# Altium project GroundStation.PrjPcb
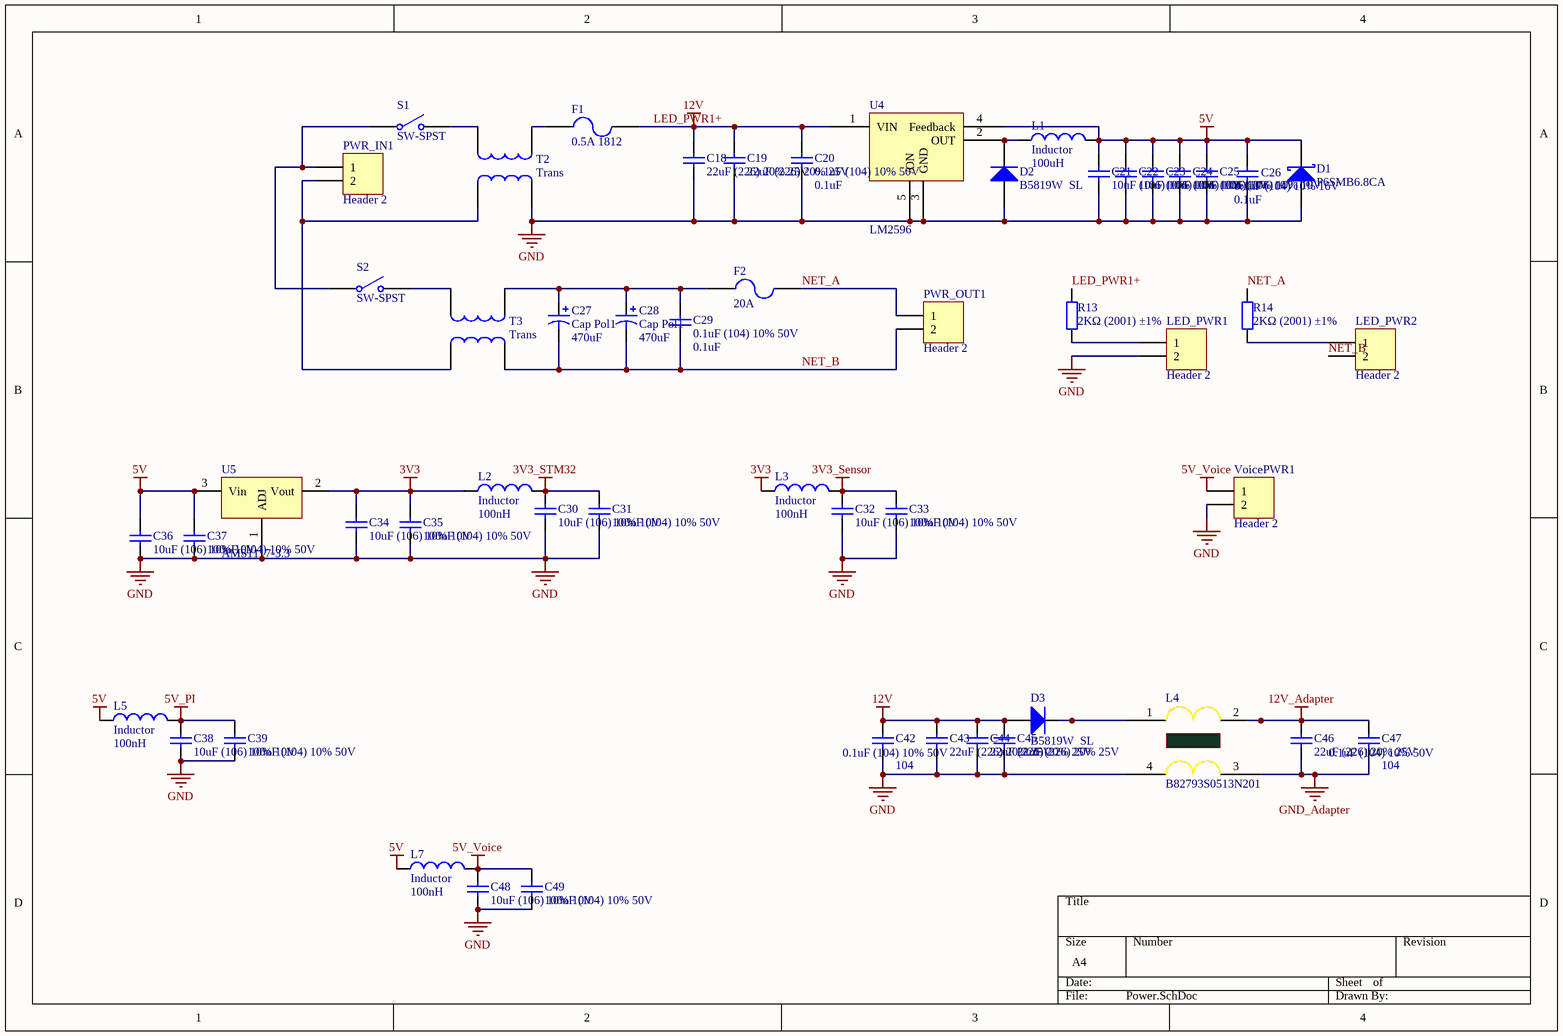
[diagram p0: Power.SchDoc]
4 sheets, 121 parts. Net scope: global (net labels, ports and power ports of the same name join across sheets).
Board file: GroundStation.PcbDoc
Sheets:
  Power.SchDoc
  State.SchDoc
  PLC_RaspberryPi.SchDoc
  MCU.SchDoc

## Sheet Power.SchDoc
size A4

### Parts
C18  22uF (226) 20% 25V  [0805_C]
C19  22uF (226) 20% 25V  [0805_C]
C20  0.1uF (104) 10% 50V  value 0.1uF  [0805_C]
C21  10uF (106) 10% 10V  [0603_C]
C22  10uF (106) 10% 10V  [0603_C]
C23  10uF (106) 10% 10V  [0603_C]
C24  10uF (106) 10% 10V  [0603_C]
C25  10uF (106) 10% 10V  [0603_C]
C26  0.1uF (104) 10% 16V  value 0.1uF  [0603_C]
C27  Cap Pol1  value 470uF  [RB5-10.5]
C28  Cap Pol1  value 470uF  [RB5-10.5]
C29  0.1uF (104) 10% 50V  value 0.1uF  [0805_C]
C30  10uF (106) 10% 10V  [0603_C]
C31  100nF (104) 10% 50V  [0603_C]
C32  10uF (106) 10% 10V  [0603_C]
C33  100nF (104) 10% 50V  [0603_C]
C34  10uF (106) 10% 10V  [0603_C]
C35  100nF (104) 10% 50V  [0603_C]
C36  10uF (106) 10% 10V  [0603_C]
C37  100nF (104) 10% 50V  [0603_C]
C38  10uF (106) 10% 10V  [0603_C]
C39  100nF (104) 10% 50V  [0603_C]
C42  0.1uF (104) 10% 50V  value 104  [0805_C]
C43  22uF (226) 20% 25V  [0805_C]
C44  22uF (226) 20% 25V  [0805_C]
C45  22uF (226) 20% 25V  [0805_C]
C46  22uF (226) 20% 25V  [0805_C]
C47  0.1uF (104) 10% 50V  value 104  [0805_C]
C48  10uF (106) 10% 10V  [0603_C]
C49  100nF (104) 10% 50V  [0603_C]
D1  P6SMB6.8CA  [SMB(DO-214AA)_S1]
D2  B5819W  SL  [SOD-123]
D3  B5819W  SL  [SOD-123]
F1  0.5A 1812  [1812]
F2  20A  [Fuse_Small]
L1  Inductor  value 100uH  [L1050(10x10x4)]
L2  Inductor  value 100nH  [0603_L]
L3  Inductor  value 100nH  [0603_L]
L4  B82793S0513N201  [B82793S0513N201_Yes]
L5  Inductor  value 100nH  [0603_L]
L7  Inductor  value 100nH  [0603_L]
LED_PWR1  Header 2  [XH2.54_2P]
LED_PWR2  Header 2  [XH2.54_2P]
PWR_IN1  Header 2  [T型口]
PWR_OUT1  Header 2  [T型口]
R13  2KΩ (2001) ±1%  [LC-0603_R]
R14  2KΩ (2001) ±1%  [LC-0603_R]
S1  SW-SPST  [XH2.54_2P]
S2  SW-SPST  [T型口]
T2  Trans  [UU9.8]
T3  Trans  [20A共模电感]
U4  LM2596  [TO-263-5]
U5  AMS1117-3.3  [SOT-223]
VoicePWR1  Header 2  [XH2.54_2P]

### Nets
3V3: C34.2 C35.2 L2.1 L3.1 U5.2(Vout)
3V3_Sensor: C32.2 C33.2 L3.2
3V3_STM32: C30.2 C31.2 L2.2
5V: C21.2 C22.2 C23.2 C24.2 C25.2 C26.2 C36.2 C37.2 D1.2(K) L1.2 L5.1 L7.1 U4.4(Feedback) U5.3(Vin)
5V_PI: C38.2 C39.2 L5.2
5V_Voice: C48.2 C49.2 L7.2 VoicePWR1.1
12V_Adapter: C46.2 C47.2 L4.2
GND: C18.1 C19.1 C20.1 C21.1 C22.1 C23.1 C24.1 C25.1 C26.1 C30.1 C31.1 C32.1 C33.1 C34.1 C35.1 C36.1 C37.1 C38.1 C39.1 C42.1 C43.1 C44.1 C45.1 C48.1 C49.1 D1.1(A) D2.1(A) L4.4 LED_PWR1.2 T2.2 U4.3(GND) U4.5(/ON) U5.1(ADJ) VoicePWR1.2
GND_Adapter: C46.1 C47.1 L4.3
LED_PWR1+: C18.2 C19.2 C20.2 C42.2 C43.2 C44.2 C45.2 D3.1(A) F1.2 R13.1 U4.1(VIN)  [also labelled 12V]
NET_A: F2.2 PWR_OUT1.1 R14.1
NET_B: C27.2 C28.2 C29.1 LED_PWR2.2 PWR_OUT1.2 T3.2
NetC27_1: C27.1 C28.1 C29.2 F2.1 T3.4
NetD2_2: D2.2(K) L1.1 U4.2(OUT)
NetD3_2: D3.2(K) L4.1
NetF1_1: F1.1 T2.4
NetLED_PWR1_1: LED_PWR1.1 R13.2
NetLED_PWR2_1: LED_PWR2.1 R14.2
NetPWR_IN1_1: PWR_IN1.1 S1.1(COMMON) S2.1(COMMON)
NetPWR_IN1_2: PWR_IN1.2 T2.1 T3.1
NetS1_2: S1.2(NO) T2.3
NetS2_2: S2.2(NO) T3.3

### Library data of the parts
C18 C19 C43-C46 = 0805 22uF (226) 20% 25V: 贴片电容; ComponentLink1Description: 供应商链接; ComponentLink1URL: http://www.szlcsc.com/product/details_46786.html; Package: 0805; Supplier: LC; SuppliersPartNumber: C45783
C20 C26 C29 C42 C47 = Cap: Capacitor; Published: 8-Jun-2000; LatestRevisionDate: 17-Jul-2002; LatestRevisionNote: Re-released for DXP Platform.; PackageReference: RAD-0.3; Publisher: Altium Limited; PackageDescription: Radial Cap, Thru-Hole; 2 Leads; 0.3 in Pin Spacing
C21-C25 C30 C32 C34 C36 C38 C48 = 0603 10uF (106) 10% 10V: 贴片电容; ComponentLink1Description: 供应商链接; ComponentLink1URL: http://www.szlcsc.com/product/details_20411.html; Package: 0603; Supplier: LC; SuppliersPartNumber: C19702
C27 C28 = Cap Pol1: Polarized Capacitor (Radial); Published: 8-Jun-2000; LatestRevisionDate: 17-Jul-2002; LatestRevisionNote: Re-released for DXP Platform.; PackageReference: RB7.6-15; Publisher: Altium Limited; PackageDescription: Polarized Capacitor (Radial); 2 Leads
C31 C33 C35 C37 C39 C49 = 0603 100nF (104) 10% 50V: 贴片电容; ComponentLink1Description: 供应商链接; ComponentLink1URL: http://www.szlcsc.com/product/details_15331.html; Package: 0603; Supplier: LC; SuppliersPartNumber: C14663
D1 = D Schottky: Schottky Diode; Published: 8-Jun-2000; LatestRevisionDate: 17-Jul-2002; LatestRevisionNote: Re-released for DXP Platform.; PackageReference: SMB; Publisher: Altium Limited; PackageDescription: DO-214-AA/SMB; 2 C-Bend Leads; Body 5.3 x 3.6 mm, inc. leads (LxW); Code_JEDEC: DO-214-AA
D2 D3 = SOD-123 B5819W  SL: 肖特基二极管; ComponentLink1Description: 供应商链接; ComponentLink1URL: http://www.szlcsc.com/product/details_9093.html; Package: SOD-123; Supplier: LC; SuppliersPartNumber: C8598
F1 F2 = Fuse 2: Fuse; Published: 8-Jun-2000; LatestRevisionDate: 17-Jul-2002; LatestRevisionNote: Re-released for DXP Platform.; PackageReference: PIN-W2/E2.8; Publisher: Altium Limited; PackageDescription: Thru-Hole; 2 Leads
L1-L3 L5 L7 = Inductor: Code_IEC: 1005; Published: 8-Jun-2000; LatestRevisionDate: 29-May-2009; LatestRevisionNote: IPC-7351 Footprint Added.; PackageReference: 0402-A; Publisher: Altium Limited; PackageDescription: Chip Inductor; Code_JEITA: 0402
LED_PWR1 LED_PWR2 PWR_IN1 PWR_OUT1 VoicePWR1 = Header 2: Header, 2-Pin; LatestRevisionDate: 17-Jul-2002; LatestRevisionNote: Re-released for DXP Platform.; Publisher: Altium Limited
R13 R14 = 0603 2KΩ (2001) 1%: 贴片电阻; ComponentLink1Description: 供应商链接; ComponentLink1URL: http://www.szlcsc.com/product/details_23702.html; Package: 0603; Supplier: LC; SuppliersPartNumber: C22975
S1 S2 = SW-SPST: Single-Pole, Single-Throw Switch; Published: 24-Mar-1999; LatestRevisionDate: 17-Jul-2002; LatestRevisionNote: Re-released for DXP Platform.; PackageReference: SPST-2; Publisher: Altium Limited; PackageDescription: Switch; 2 Leads
T2 T3 = Trans: Transformer; Published: 24-Mar-1999; LatestRevisionDate: 08-Jul-2005; LatestRevisionNote: Mech Layer 1 removed.; PackageReference: TRANS; Publisher: Altium Limited; PackageDescription: Transformer; 4 Leads
U4 = LM2576
U5 = LM317: 3-Terminal Adjustable Positive Voltage Regulator

## Sheet State.SchDoc
size A4
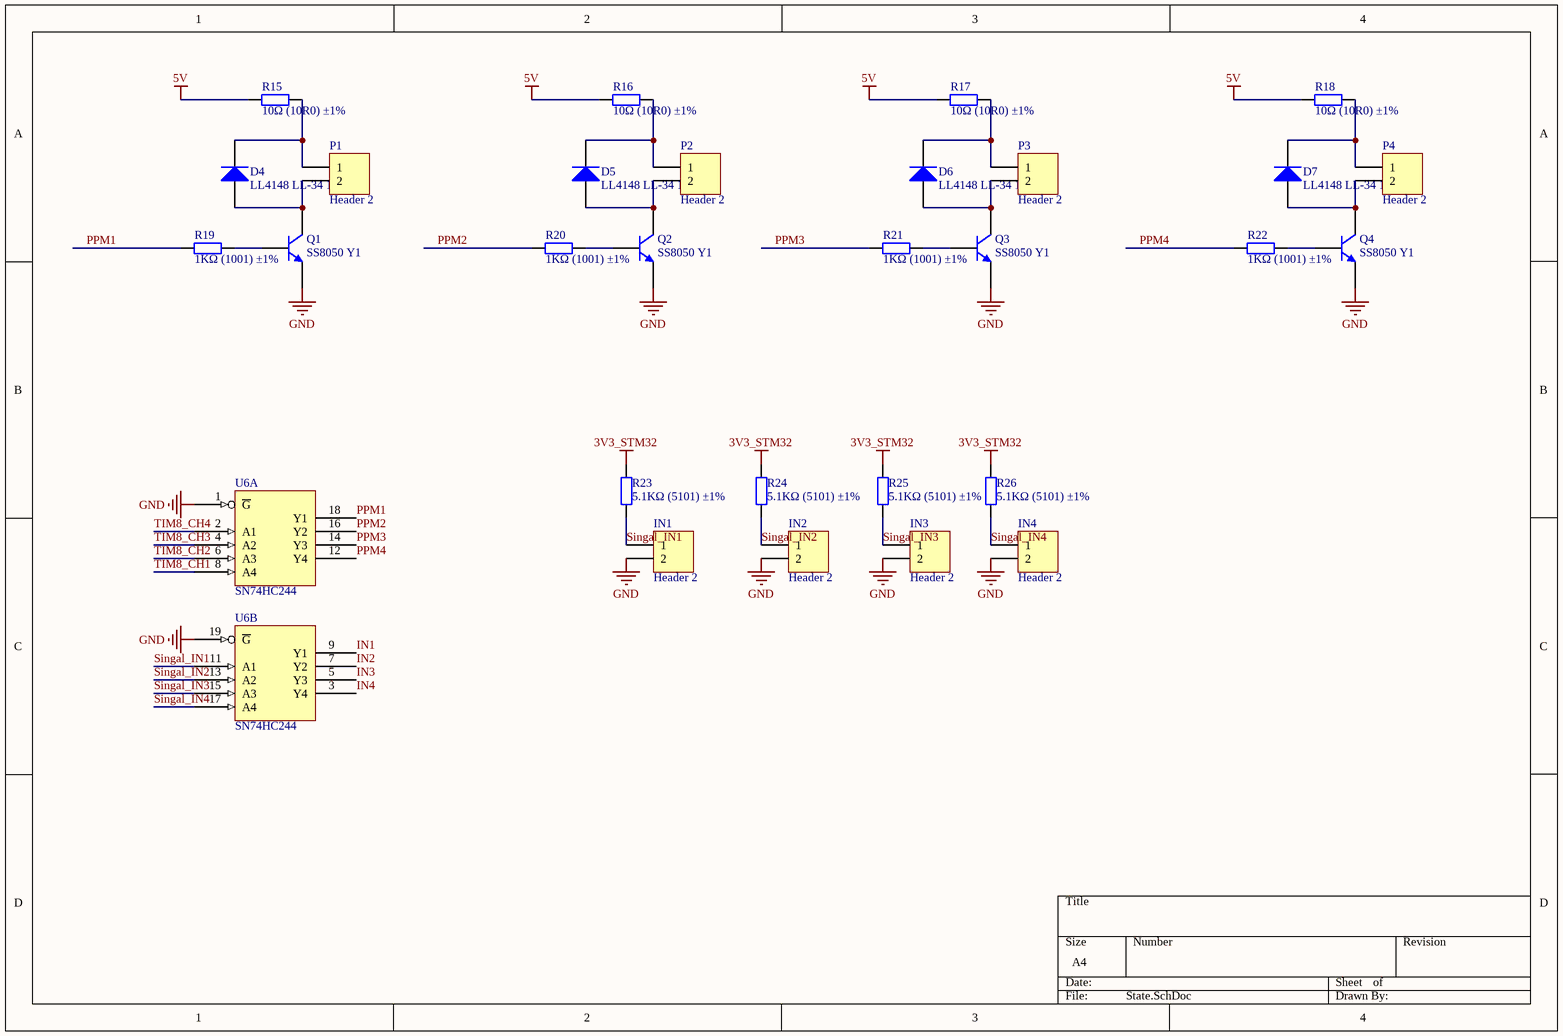
[diagram p1: State.SchDoc]

### Parts
D4  LL4148 LL-34 1206  [LL-34]
D5  LL4148 LL-34 1206  [LL-34]
D6  LL4148 LL-34 1206  [LL-34]
D7  LL4148 LL-34 1206  [LL-34]
IN1  Header 2  [XH2.54_2P]
IN2  Header 2  [XH2.54_2P]
IN3  Header 2  [XH2.54_2P]
IN4  Header 2  [XH2.54_2P]
P1  Header 2  [XH2.54_2P]
P2  Header 2  [XH2.54_2P]
P3  Header 2  [XH2.54_2P]
P4  Header 2  [XH2.54_2P]
Q1  SS8050 Y1  [SOT-23(SOT-23-3)]
Q2  SS8050 Y1  [SOT-23(SOT-23-3)]
Q3  SS8050 Y1  [SOT-23(SOT-23-3)]
Q4  SS8050 Y1  [SOT-23(SOT-23-3)]
R15  10Ω (10R0) ±1%  [1206_R]
R16  10Ω (10R0) ±1%  [1206_R]
R17  10Ω (10R0) ±1%  [1206_R]
R18  10Ω (10R0) ±1%  [1206_R]
R19  1KΩ (1001) ±1%  [0603_R]
R20  1KΩ (1001) ±1%  [0603_R]
R21  1KΩ (1001) ±1%  [0603_R]
R22  1KΩ (1001) ±1%  [0603_R]
R23  5.1KΩ (5101) ±1%  [LC-0603_R]
R24  5.1KΩ (5101) ±1%  [LC-0603_R]
R25  5.1KΩ (5101) ±1%  [LC-0603_R]
R26  5.1KΩ (5101) ±1%  [LC-0603_R]
U6  SN74HC244  [SOIC-20_300mil]  (parts A,B of 2)

### Nets
3V3: U6.20(VCC)
3V3_STM32: R23.2 R24.2 R25.2 R26.2
5V: R15.2 R16.2 R17.2 R18.2
GND: IN1.2 IN2.2 IN3.2 IN4.2 Q1.2(E) Q2.2(E) Q3.2(E) Q4.2(E) U6.1(~{G}) U6.10(GND) U6.19(~{G})
IN1: U6.9(Y1)
IN2: U6.7(Y2)
IN3: U6.5(Y3)
IN4: U6.3(Y4)
PPM1: R19.1 U6.18(Y1)
PPM2: R20.1 U6.16(Y2)
PPM3: R21.1 U6.14(Y3)
PPM4: R22.1 U6.12(Y4)
Singal_IN1: IN1.1 R23.1 U6.11(A1)
Singal_IN2: IN2.1 R24.1 U6.13(A2)
Singal_IN3: IN3.1 R25.1 U6.15(A3)
Singal_IN4: IN4.1 R26.1 U6.17(A4)
TIM8_CH1: U6.8(A4)
TIM8_CH2: U6.6(A3)
TIM8_CH3: U6.4(A2)
TIM8_CH4: U6.2(A1)
NetD4_1: D4.1(A) P1.2 Q1.3(C)
NetD4_2: D4.2(K) P1.1 R15.1
NetD5_1: D5.1(A) P2.2 Q2.3(C)
NetD5_2: D5.2(K) P2.1 R16.1
NetD6_1: D6.1(A) P3.2 Q3.3(C)
NetD6_2: D6.2(K) P3.1 R17.1
NetD7_1: D7.1(A) P4.2 Q4.3(C)
NetD7_2: D7.2(K) P4.1 R18.1
NetQ1_1: Q1.1(B) R19.2
NetQ2_1: Q2.1(B) R20.2
NetQ3_1: Q3.1(B) R21.2
NetQ4_1: Q4.1(B) R22.2

### Library data of the parts
D4-D7 = LL-34 LL4148 LL-34 1206: 开关二极管; ComponentLink1Description: 供应商链接; ComponentLink1URL: http://www.szlcsc.com/product/details_10338.html; Package: LL-34; Supplier: LC; SuppliersPartNumber: C9808
IN1-IN4 P1-P4 = Header 2: Header, 2-Pin; LatestRevisionDate: 17-Jul-2002; LatestRevisionNote: Re-released for DXP Platform.; Publisher: Altium Limited
Q1-Q4 = SOT-23 SS8050 Y1: 三极管; ComponentLink1Description: 供应商链接; ComponentLink1URL: http://www.szlcsc.com/product/details_2507.html; Package: SOT-23; Supplier: LC; SuppliersPartNumber: C2150
R15-R18 = 1206 10Ω (10R0) 1%: 贴片电阻; ComponentLink1Description: 供应商链接; ComponentLink1URL: http://www.szlcsc.com/product/details_18591.html; Package: 1206; Supplier: LC; SuppliersPartNumber: C17903
R19-R22 = 0603 1KΩ (1001) 1%: 贴片电阻; ComponentLink1Description: 供应商链接; ComponentLink1URL: http://www.szlcsc.com/product/details_21904.html; Package: 0603; Supplier: LC; SuppliersPartNumber: C21190
R23-R26 = 0603 5.1KΩ (5101) 1%: 贴片电阻; ComponentLink1Description: 供应商链接; ComponentLink1URL: http://www.szlcsc.com/product/details_23913.html; Package: 0603; Supplier: LC; SuppliersPartNumber: C23186
U6 = SN74HC244: OCTAL BUF AND LIN DRV 3SO

## Sheet PLC_RaspberryPi.SchDoc
size A4
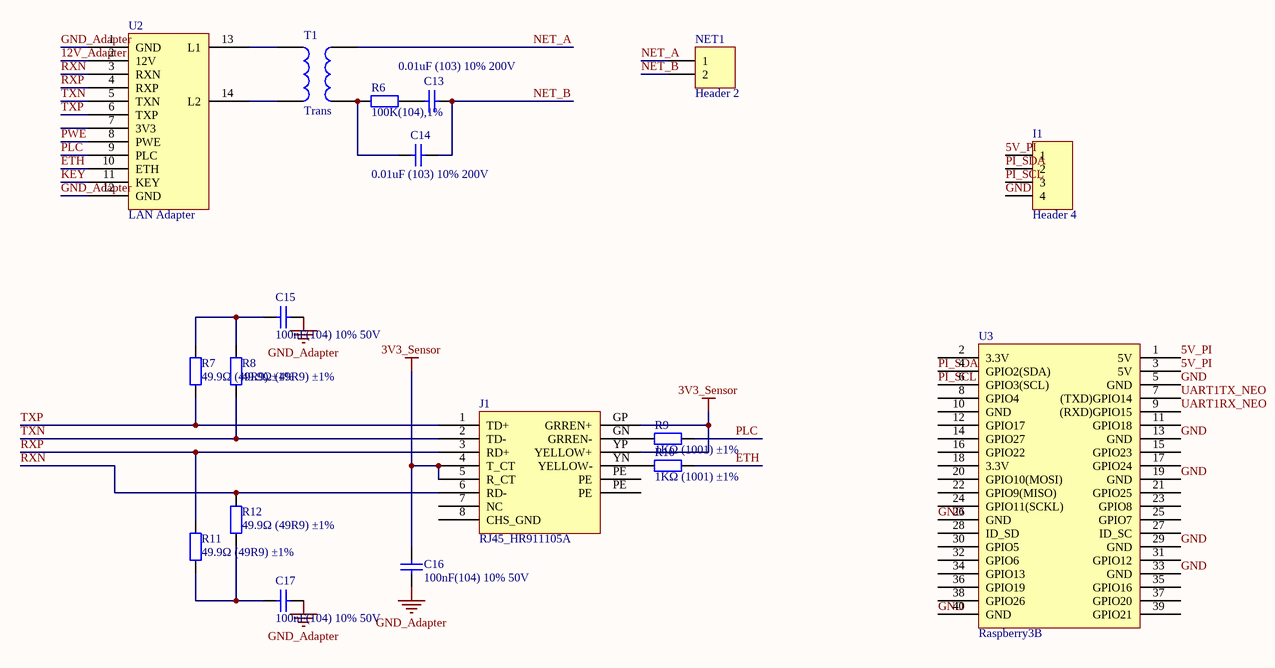
[diagram p2: PLC_RaspberryPi.SchDoc]

### Parts
C13  0.01uF (103) 10% 200V  [1206_C]
C14  0.01uF (103) 10% 200V  [1206_C]
C15  100nF(104) 10% 50V  [0603_C]
C16  100nF(104) 10% 50V  [0603_C]
C17  100nF(104) 10% 50V  [0603_C]
I1  Header 4  [XH2.54_4P]
J1  RJ45_HR911105A  [RJ45_3]
NET1  Header 2  [XH2.54_2P]
R6  100K(104),1%  [1206_R]
R7  49.9Ω (49R9) ±1%  [0603_R]
R8  49.9Ω (49R9) ±1%  [0603_R]
R9  1KΩ (1001) ±1%  [0603_R]
R10  1KΩ (1001) ±1%  [0603_R]
R11  49.9Ω (49R9) ±1%  [0603_R]
R12  49.9Ω (49R9) ±1%  [0603_R]
T1  Trans  [SW-80]
U2  LAN Adapter  [LAN Adapter]
U3  Raspberry3B  [HDR2X20]

### Nets
3V3_Sensor: C16.2 J1.4(T_CT) J1.5(R_CT) J1.GP(GRREN+) J1.YP(YELLOW+)
5V_PI: I1.1 U3.1(5V) U3.3(5V)
12V_Adapter: U2.2(12V)
GND: I1.4 U3.5(GND) U3.13(GND) U3.19(GND) U3.26(GND) U3.29(GND) U3.33(GND) U3.40(GND)
GND_Adapter: C15.1 C16.1 C17.1 U2.1(GND) U2.12(GND)
ETH: R10.2 U2.10(ETH)
KEY: U2.11(KEY)
NET_A: NET1.1 T1.3
NET_B: C13.1 C14.1 NET1.2
PI_SCL: I1.3 U3.6(GPIO3(SCL))
PI_SDA: I1.2 U3.4(GPIO2(SDA))
PLC: R9.2 U2.9(PLC)
PWE: U2.8(PWE)
RXN: J1.6(RD-) R12.2 U2.3(RXN)
RXP: J1.3(RD+) R11.2 U2.4(RXP)
TXN: J1.2(TD-) R8.1 U2.5(TXN)
TXP: J1.1(TD+) R7.1 U2.6(TXP)
UART1RX_NEO: U3.9((RXD)GPIO15)
UART1TX_NEO: U3.7((TXD)GPIO14)
NetC13_2: C13.2 R6.2
NetC14_2: C14.2 R6.1 T1.4
NetC15_2: C15.2 R7.2 R8.2
NetC17_2: C17.2 R11.1 R12.1
NetJ1_GN: J1.GN(GRREN-) R9.1
NetJ1_YN: J1.YN(YELLOW-) R10.1
NetT1_1: T1.1 U2.13(L1)
NetT1_2: T1.2 U2.14(L2)

Not connected (* = marked no-connect by the designer): J1 7(NC) 8(CHS_GND) PE; U2 7(3V3); U3 2(3.3V) 8(GPIO4) 10(GND) 11(GPIO18) 12(GPIO17) 14(GPIO27) 15(GPIO23) 16(GPIO22) 17(GPIO24) 18(3.3V) 20(GPIO10(MOSI)) 21(GPIO25) 22(GPIO9(MISO)) 23(GPIO8) 24(GPIO11(SCKL)) 25(GPIO7) 27(ID_SC) 28(ID_SD) 30(GPIO5) 31(GPIO12) 32(GPIO6) 34(GPIO13) 35(GPIO16) 36(GPIO19) 37(GPIO20) 38(GPIO26) 39(GPIO21)

### Library data of the parts
C13 C14 = Cap: Capacitor; Value: 104; Published: 8-Jun-2000; LatestRevisionDate: 17-Jul-2002; LatestRevisionNote: Re-released for DXP Platform.; Publisher: Altium Limited
C15-C17 = 0805 100nF(104) 10% 50V: 贴片电容; ComponentLink1Description: 供应商链接; ComponentLink1URL: http://www.szlcsc.com/product/details_50686.html; Package: 0805; Supplier: LC; SuppliersPartNumber: C49678
I1 = Header 4: Header, 4-Pin; LatestRevisionDate: 17-Jul-2002; LatestRevisionNote: Re-released for DXP Platform.; Publisher: Altium Limited
NET1 = Header 2: Header, 2-Pin; LatestRevisionDate: 17-Jul-2002; LatestRevisionNote: Re-released for DXP Platform.; Publisher: Altium Limited
R6 = Res2: Resistor; Published: 8-Jun-2000; LatestRevisionDate: 17-Jul-2002; LatestRevisionNote: Re-released for DXP Platform.; Publisher: Altium Limited
R7 R8 R11 R12 = 0805 49.9Ω (49R9) 1%: 贴片电阻; ComponentLink1Description: 供应商链接; ComponentLink1URL: http://www.szlcsc.com/product/details_18408.html; Package: 0805; Supplier: LC; SuppliersPartNumber: C17720
R9 R10 = 0603 1KΩ (1001) 1%: 贴片电阻; ComponentLink1Description: 供应商链接; ComponentLink1URL: http://www.szlcsc.com/product/details_21904.html; Package: 0603; Supplier: LC; SuppliersPartNumber: C21190
T1 = Trans: Transformer; Published: 24-Mar-1999; LatestRevisionDate: 08-Jul-2005; LatestRevisionNote: Mech Layer 1 removed.; PackageReference: TRANS; Publisher: Altium Limited; PackageDescription: Transformer; 4 Leads

## Sheet MCU.SchDoc
size A4
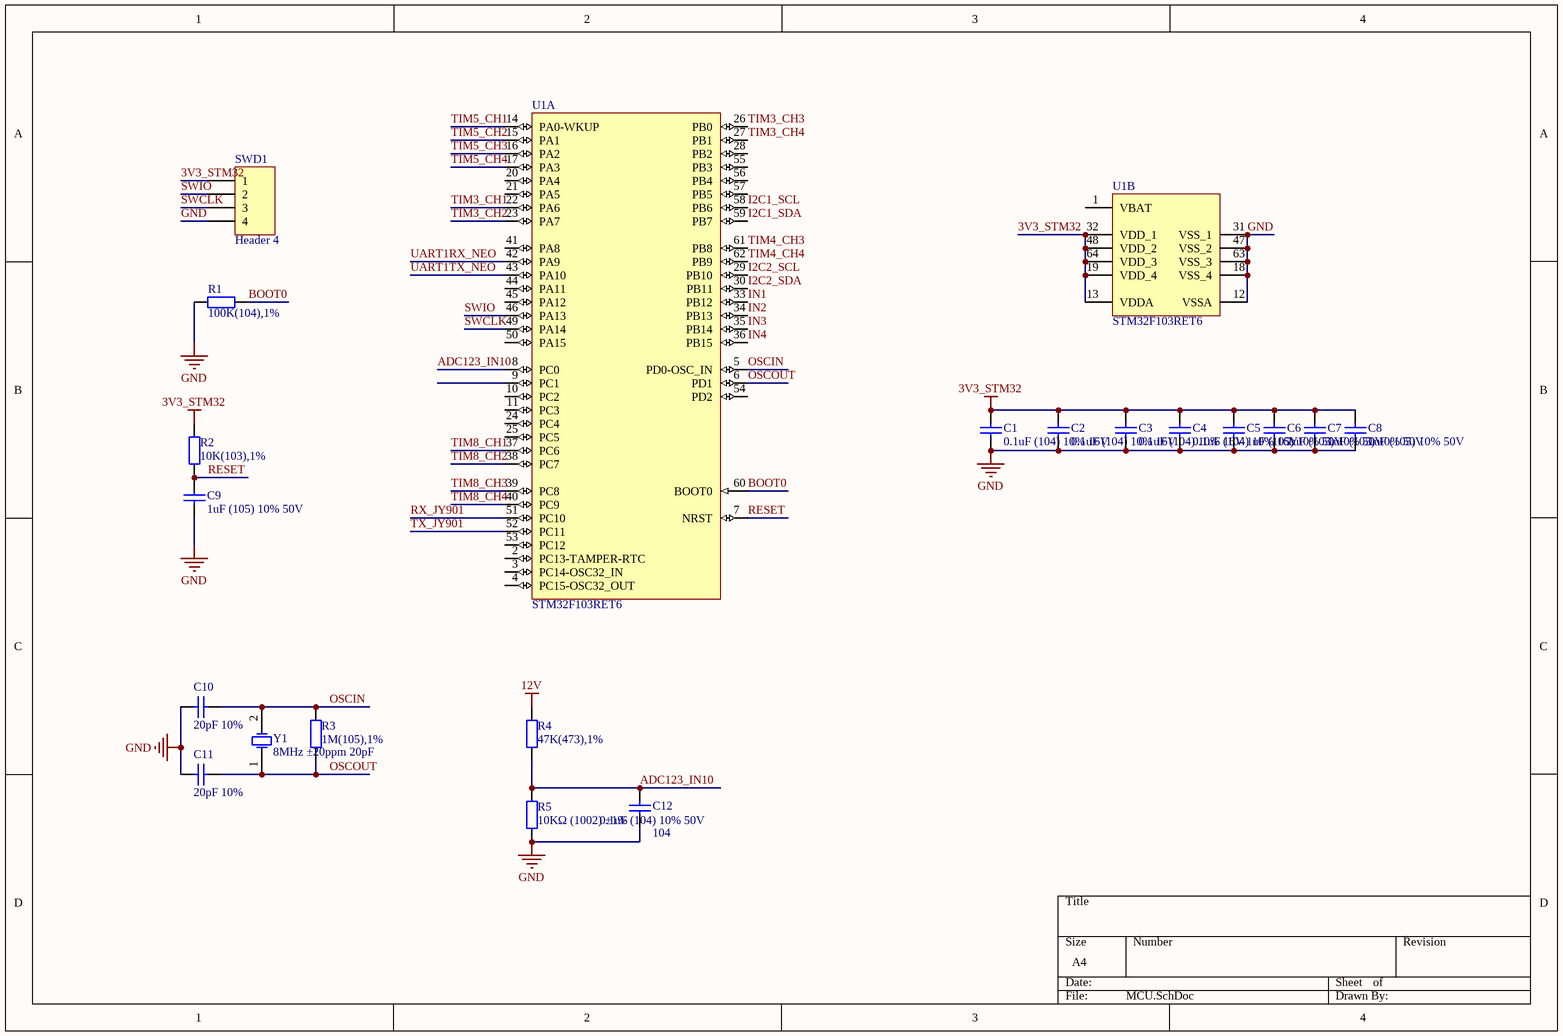
[diagram p3: MCU.SchDoc]

### Parts
C1  0.1uF (104) 10% 16V  [0603_C]
C2  0.1uF (104) 10% 16V  [0603_C]
C3  0.1uF (104) 10% 16V  [0603_C]
C4  0.1uF (104) 10% 16V  [0603_C]
C5  1uF (105) 10% 50V  [0603_C]
C6  1uF (105) 10% 50V  [0603_C]
C7  1uF (105) 10% 50V  [0603_C]
C8  1uF (105) 10% 50V  [0603_C]
C9  1uF (105) 10% 50V  [0603_C]
C10  20pF 10%  [0603_C]
C11  20pF 10%  [0603_C]
C12  0.1uF (104) 10% 50V  value 104  [0603_C]
R1  100K(104),1%  [0603_R]
R2  10K(103),1%  [0603_R]
R3  1M(105),1%  [0603_R]
R4  47K(473),1%  [0603_R]
R5  10KΩ (1002) ±1%  [0603_R]
SWD1  Header 4  [HDR1X4]
U1  STM32F103RET6  [LQFP-64_10x10x05P]  (parts A,B of 2)
Y1  8MHz ±20ppm 20pF  [SMD-5032_2P]

### Nets
3V3_STM32: C1.2 C2.2 C3.2 C4.2 C5.2 C6.2 C7.2 C8.2 R2.2 SWD1.1 U1.13(VDDA) U1.19(VDD_4) U1.32(VDD_1) U1.48(VDD_2) U1.64(VDD_3)
12V: R4.2  [project net LED_PWR1+]
GND: C1.1 C2.1 C3.1 C4.1 C5.1 C6.1 C7.1 C8.1 C9.1 C10.2 C11.2 C12.1 R1.1 R5.1 SWD1.4 U1.12(VSSA) U1.18(VSS_4) U1.31(VSS_1) U1.47(VSS_2) U1.63(VSS_3)
ADC123_IN10: C12.2 R4.1 R5.2 U1.8(PC0)
BOOT0: R1.2 U1.60(BOOT0)
I2C1_SCL: U1.58(PB6)
I2C1_SDA: U1.59(PB7)
I2C2_SCL: U1.29(PB10)
I2C2_SDA: U1.30(PB11)
IN1: U1.33(PB12)
IN2: U1.34(PB13)
IN3: U1.35(PB14)
IN4: U1.36(PB15)
OSCIN: C10.1 R3.2 U1.5(PD0-OSC_IN) Y1.2(OSC2)
OSCOUT: C11.1 R3.1 U1.6(PD1) Y1.1(OSC1)
RESET: C9.2 R2.1 U1.7(NRST)
RX_JY901: U1.51(PC10)
SWCLK: SWD1.3 U1.49(PA14)
SWIO: SWD1.2 U1.46(PA13)
TIM3_CH1: U1.22(PA6)
TIM3_CH2: U1.23(PA7)
TIM3_CH3: U1.26(PB0)
TIM3_CH4: U1.27(PB1)
TIM4_CH3: U1.61(PB8)
TIM4_CH4: U1.62(PB9)
TIM5_CH1: U1.14(PA0-WKUP)
TIM5_CH2: U1.15(PA1)
TIM5_CH3: U1.16(PA2)
TIM5_CH4: U1.17(PA3)
TIM8_CH1: U1.37(PC6)
TIM8_CH2: U1.38(PC7)
TIM8_CH3: U1.39(PC8)
TIM8_CH4: U1.40(PC9)
TX_JY901: U1.52(PC11)
UART1RX_NEO: U1.42(PA9)
UART1TX_NEO: U1.43(PA10)

Not connected (* = marked no-connect by the designer): U1 1(VBAT) 2(PC13-TAMPER-RTC) 3(PC14-OSC32_IN) 4(PC15-OSC32_OUT) 9(PC1) 10(PC2) 11(PC3) 20(PA4) 21(PA5) 24(PC4) 25(PC5) 28(PB2) 41(PA8) 44(PA11) 45(PA12) 50(PA15) 53(PC12) 54(PD2) 55(PB3) 56(PB4) 57(PB5)

### Library data of the parts
C1-C4 C10 C11 = Cap: Capacitor; Value: 104; Published: 8-Jun-2000; LatestRevisionDate: 17-Jul-2002; LatestRevisionNote: Re-released for DXP Platform.; Publisher: Altium Limited
C5-C8 = 0603 1uF (105) 10% 50V: 贴片电容; ComponentLink1Description: 供应商链接; ComponentLink1URL: http://www.szlcsc.com/product/details_16531.html; Package: 0603; Supplier: LC; SuppliersPartNumber: C15849
C9 = Cap: Capacitor; Value: 105; Published: 8-Jun-2000; LatestRevisionDate: 17-Jul-2002; LatestRevisionNote: Re-released for DXP Platform.; Publisher: Altium Limited
C12 = Cap: Capacitor; Published: 8-Jun-2000; LatestRevisionDate: 17-Jul-2002; LatestRevisionNote: Re-released for DXP Platform.; PackageReference: RAD-0.3; Publisher: Altium Limited; PackageDescription: Radial Cap, Thru-Hole; 2 Leads; 0.3 in Pin Spacing
R1-R4 = Res2: Resistor; Published: 8-Jun-2000; LatestRevisionDate: 17-Jul-2002; LatestRevisionNote: Re-released for DXP Platform.; Publisher: Altium Limited
R5 = 0603 10KΩ (1002) 1%: 贴片电阻; ComponentLink1Description: 供应商链接; ComponentLink1URL: http://www.szlcsc.com/product/details_26547.html; Package: 0603; Supplier: LC; SuppliersPartNumber: C25804
SWD1 = Header 4: Header, 4-Pin; LatestRevisionDate: 17-Jul-2002; LatestRevisionNote: Re-released for DXP Platform.; Publisher: Altium Limited
U1 = STM32F103RET6: ARM; ComponentLink1Description: 供应商链接; ComponentLink1URL: http://www.szlcsc.com/product/details_8814.html; Package: LQFP-64_10x10x05P; Supplier: LC; SuppliersPartNumber: C8322
Y1 = SMD-5032_2P 8MHz 20ppm 20pF: 贴片晶振; ComponentLink1Description: 供应商链接; ComponentLink1URL: http://www.szlcsc.com/product/details_19261.html; Package: SMD-5032_2P; Supplier: LC; SuppliersPartNumber: C18560

## Nets that join several sheets
3V3: Power (5 pins), State (U6.20)
3V3_Sensor: Power (C32.2 C33.2 L3.2), PLC_RaspberryPi (5 pins)
3V3_STM32: Power (C30.2 C31.2 L2.2), State (R23.2 R24.2 R25.2 R26.2), MCU (15 pins)
5V: Power (14 pins), State (R15.2 R16.2 R17.2 R18.2)
5V_PI: Power (C38.2 C39.2 L5.2), PLC_RaspberryPi (I1.1 U3.1 U3.3)
12V_Adapter: Power (C46.2 C47.2 L4.2), PLC_RaspberryPi (U2.2)
GND: Power (34 pins), State (11 pins), PLC_RaspberryPi (8 pins), MCU (20 pins)
GND_Adapter: Power (C46.1 C47.1 L4.3), PLC_RaspberryPi (5 pins)
LED_PWR1+: Power (11 pins), MCU (R4.2)
IN1: State (U6.9), MCU (U1.33)
IN2: State (U6.7), MCU (U1.34)
IN3: State (U6.5), MCU (U1.35)
IN4: State (U6.3), MCU (U1.36)
NET_A: Power (F2.2 PWR_OUT1.1 R14.1), PLC_RaspberryPi (NET1.1 T1.3)
NET_B: Power (6 pins), PLC_RaspberryPi (C13.1 C14.1 NET1.2)
TIM8_CH1: State (U6.8), MCU (U1.37)
TIM8_CH2: State (U6.6), MCU (U1.38)
TIM8_CH3: State (U6.4), MCU (U1.39)
TIM8_CH4: State (U6.2), MCU (U1.40)
UART1RX_NEO: PLC_RaspberryPi (U3.9), MCU (U1.42)
UART1TX_NEO: PLC_RaspberryPi (U3.7), MCU (U1.43)